# EAGLE design v0.4.0 (EAGLE 9.2.0)

## Sheet 1 of 2: Interface
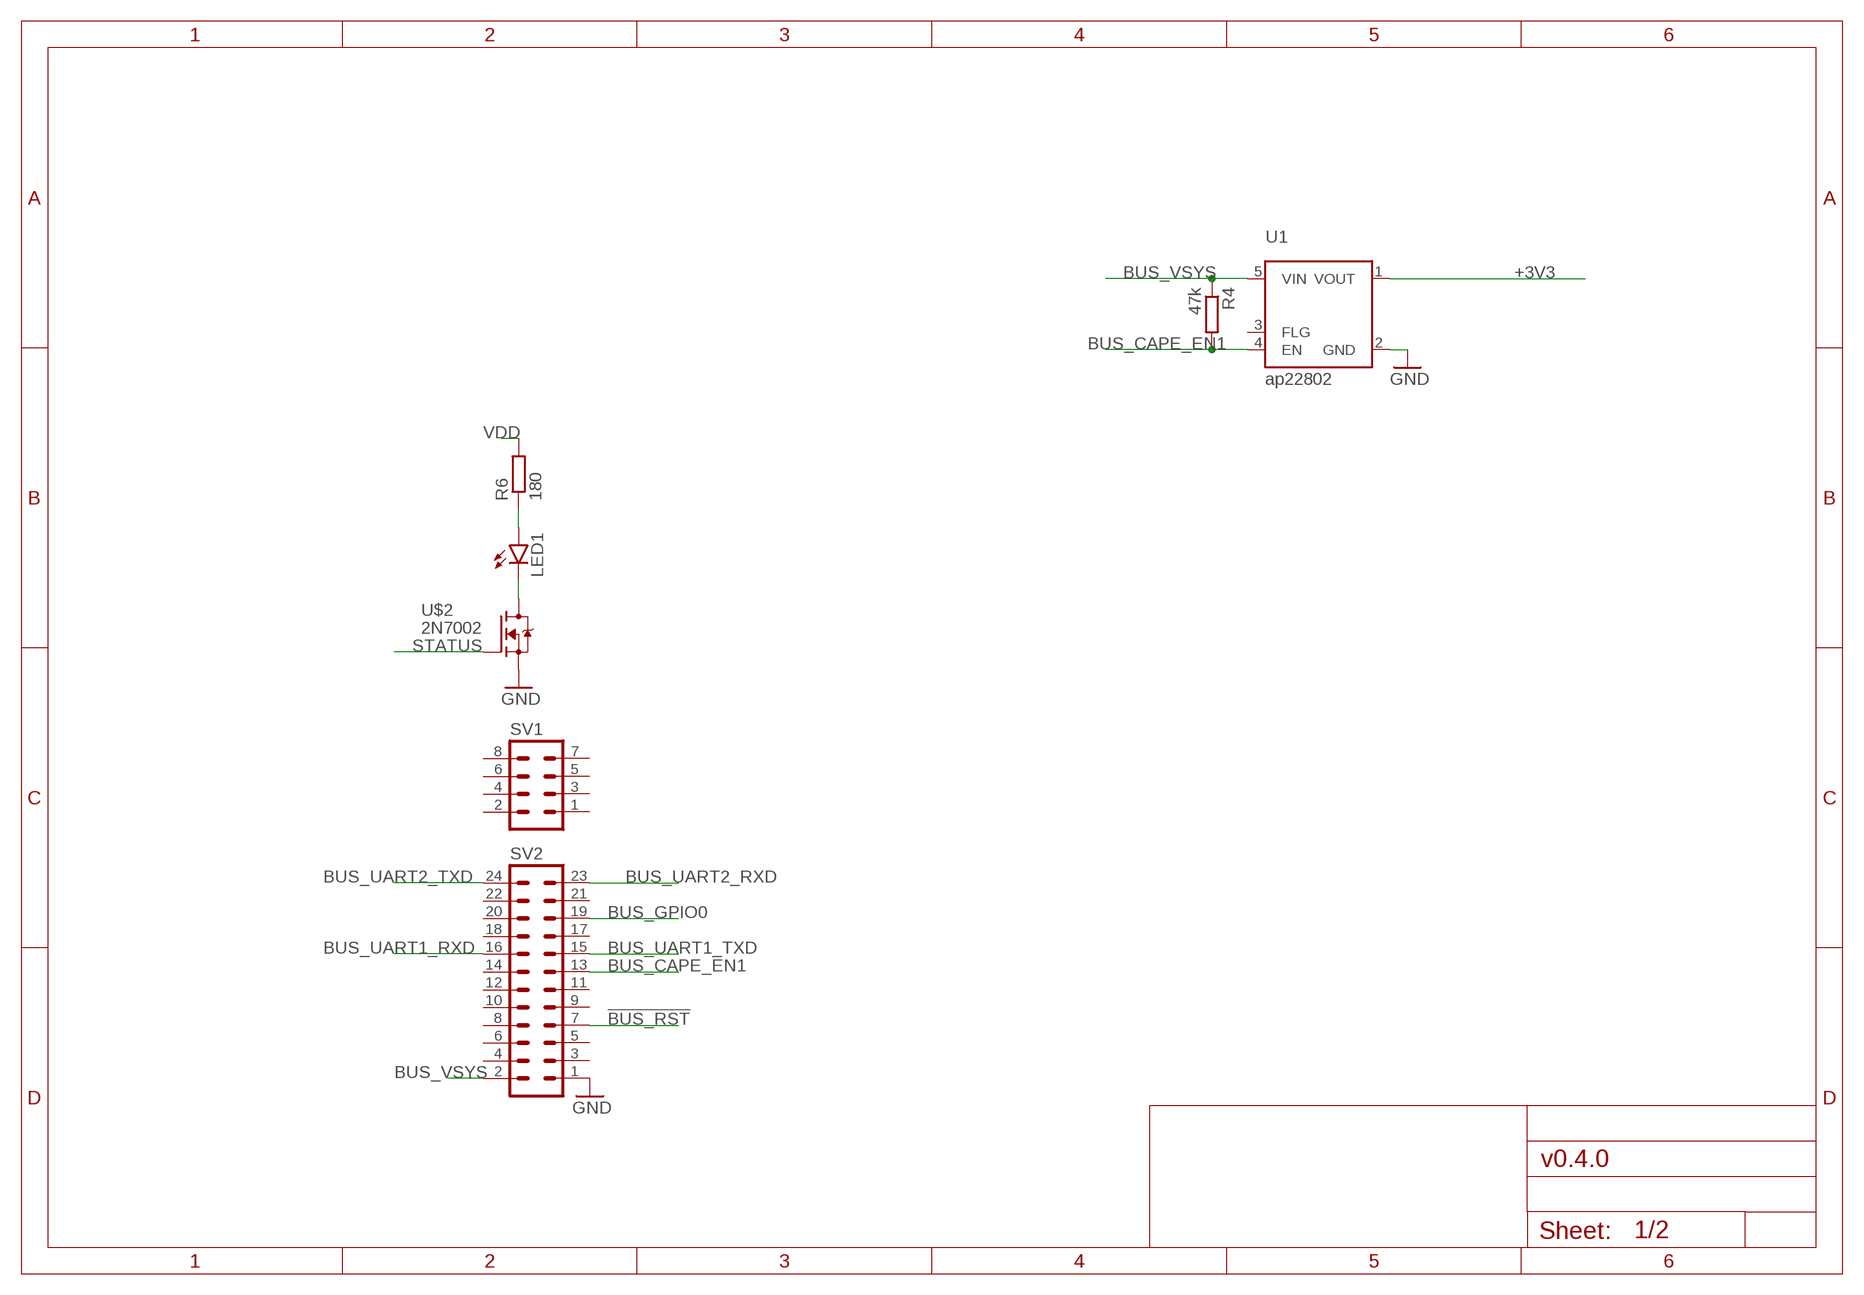
[diagram p0: schematic, sheet 1]

### Parts
LED1  LEDCHIP-LED0603  [CHIP-LED0603]
R4  47k  R-EU_R0402  [R0402]
R6  180  R-EU_R0402  [R0402]
SV1  MA04-2  [MA04-2]
SV2  MA12-2  [MA12-2]
U1  ap22802  AP22802  [SOT25]
U$2  2N7002  [SOT95P240X110-3]

### Nets
!BUS_RST: SV2.7 ; also sheet 2
+3V3: U1.1(VOUT) ; also sheet 2
BUS_CAPE_EN1: R4.2 SV2.13 U1.4(EN) ; also sheet 2
BUS_GPIO0: SV2.19 ; also sheet 2
BUS_UART1_RXD: SV2.16 ; also sheet 2
BUS_UART1_TXD: SV2.15 ; also sheet 2
BUS_UART2_RXD: SV2.23 ; also sheet 2
BUS_UART2_TXD: SV2.24 ; also sheet 2
BUS_VSYS: R4.1 SV2.2 U1.5(VIN)
GND: SV2.1 U1.2(GND) U$2.2(S) ; also sheet 2
N$6: LED1.C U$2.3(D)
N$12: LED1.A R6.1
STATUS: U$2.1(G) ; also sheet 2
VDD: R6.2 ; also sheet 2
Unconnected: SV1.1 SV1.2 SV1.3 SV1.4 SV1.5 SV1.6 SV1.7 SV1.8 SV2.3 SV2.4 SV2.5 SV2.6 SV2.8 SV2.9 SV2.10 SV2.11 SV2.12 SV2.14 SV2.17 SV2.18 SV2.20 SV2.21 SV2.22 U1.3(FLG)

## Sheet 2 of 2: GSM modem
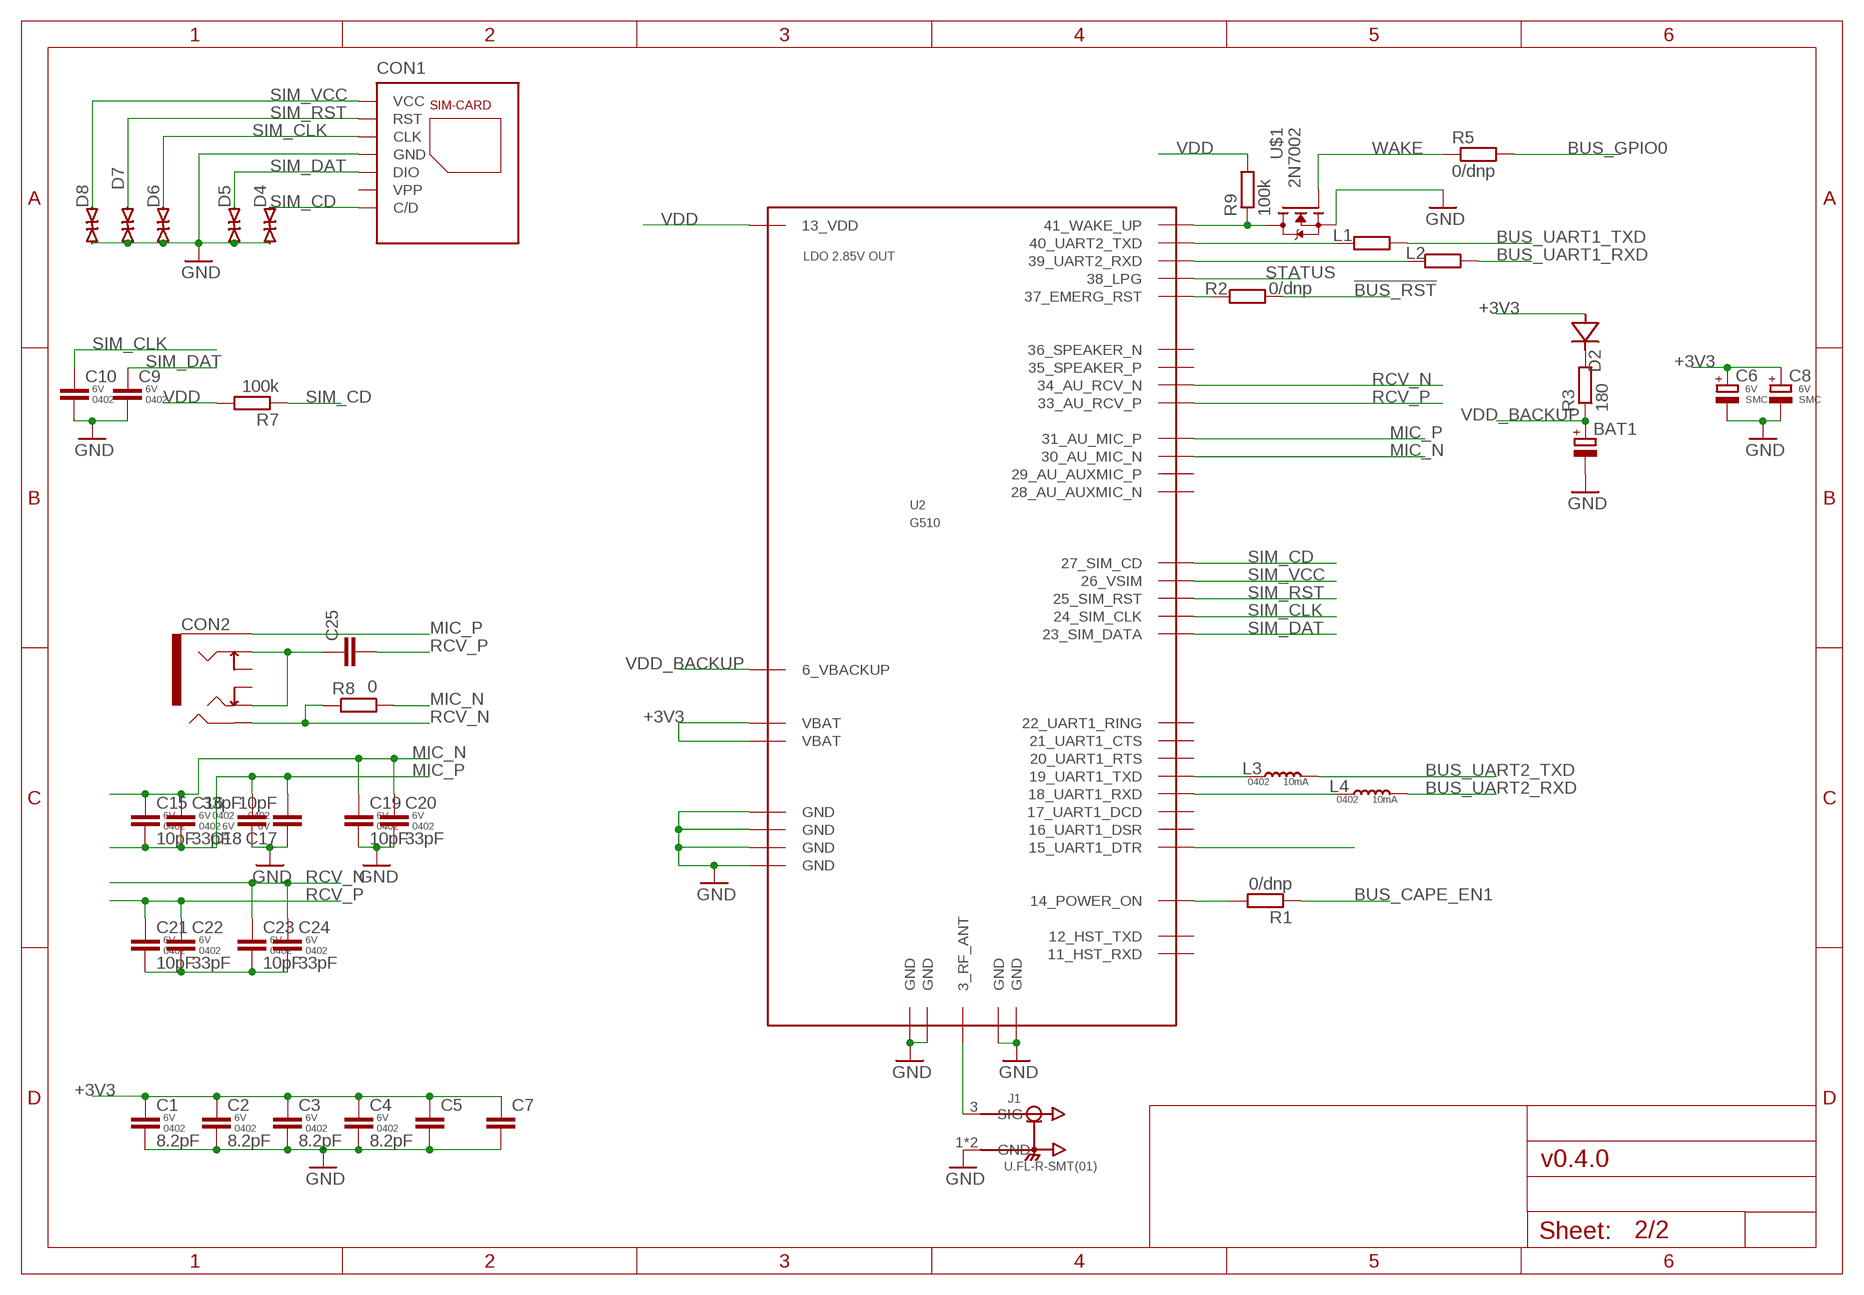
[diagram p1: schematic, sheet 2]

### Parts
BAT1  DCK-3R3E224U-E  [621]
C1  8.2pF  CAP-0402  [C0402K]
C2  8.2pF  CAP-0402  [C0402K]
C3  8.2pF  CAP-0402  [C0402K]
C4  8.2pF  CAP-0402  [C0402K]
C5  C-EUC0603  [C0603]
C6  CAP-POL-SMC  [SMC_C]
C7  C-EUC0603  [C0603]
C8  CAP-POL-SMC  [SMC_C]
C9  CAP-0402  [C0402K]
C10  CAP-0402  [C0402K]
C15  10pF  CAP-0402  [C0402K]
C16  33pF  CAP-0402  [C0402K]
C17  10pF  CAP-0402  [C0402K]
C18  33pF  CAP-0402  [C0402K]
C19  10pF  CAP-0402  [C0402K]
C20  33pF  CAP-0402  [C0402K]
C21  10pF  CAP-0402  [C0402K]
C22  33pF  CAP-0402  [C0402K]
C23  10pF  CAP-0402  [C0402K]
C24  33pF  CAP-0402  [C0402K]
C25  C-EUC0603  [C0603]
CON1  115Q-BCA0  [115Q]
CON2  1503-21  [150321]
D2  1N4148WS  [SOD323]
D4  ESD9B5.0ST5G  [SOD1006X40]
D5  ESD9B5.0ST5G  [SOD1006X40]
D6  ESD9B5.0ST5G  [SOD1006X40]
D7  ESD9B5.0ST5G  [SOD1006X40]
D8  ESD9B5.0ST5G  [SOD1006X40]
J1  U.FL-R-SMT(01)  [HRS_U.FL-R-SMT(01)]
L1  R-EU_R0402  [R0402]
L2  R-EU_R0402  [R0402]
L3  IND-0402  [L0402]
L4  IND-0402  [L0402]
R1  0/dnp  R-EU_R0402  [R0402]
R2  0/dnp  R-EU_R0402  [R0402]
R3  180  R-EU_R0402  [R0402]
R5  0/dnp  R-EU_R0402  [R0402]
R7  100k  R-EU_R0402  [R0402]
R8  0  R-EU_R0402  [R0402]
R9  100k  R-EU_R0402  [R0402]
U2  G510  [G510]
U$1  2N7002  [SOT95P240X110-3]

### Nets
!BUS_RST: R2.2 ; also sheet 1
+3V3: C1.1 C2.1 C3.1 C4.1 C5.1 C6.+ C7.1 C8.+ D2.A U2.9_VBAT(VBAT) U2.10_VBAT(VBAT) ; also sheet 1
BUS_CAPE_EN1: R1.1 ; also sheet 1
BUS_GPIO0: R5.2 ; also sheet 1
BUS_UART1_RXD: L2.2 ; also sheet 1
BUS_UART1_TXD: L1.2 ; also sheet 1
BUS_UART2_RXD: L4.2 ; also sheet 1
BUS_UART2_TXD: L3.2 ; also sheet 1
GND: BAT1.- C1.2 C2.2 C3.2 C4.2 C5.2 C6.- C7.2 C8.- C9.2 C10.2 C17.1 C18.1 C19.2 C20.2 CON1.GND1(GND) CON1.GND2(GND) CON1.GND3(GND) CON1.GND4(GND) CON1.P5(GND) D4.1(A) D5.1(A) D6.1(A) D7.1(A) D8.1(A) J1.1(GND) J1.2(GND) U2.1_GND(GND) U2.2_GND(GND) U2.4_GND(GND) U2.5_GND(GND) U2.7_GND(GND) U2.8_GND(GND) U2.32_GND(GND) U2.42_GND(GND) U$1.2(S) ; also sheet 1
MIC_N: C15.1 C16.1 C19.1 C20.1 R8.2 U2.30_AU_MIC_N
MIC_P: C15.2 C16.2 C17.2 C18.2 CON2.1 U2.31_AU_MIC_P
N$1: C21.2 C22.2 C23.2 C24.2
N$2: L3.1 U2.19_UART1_TXD
N$4: J1.3(SIG) U2.3_RF_ANT
N$5: U2.15_UART1_DTR
N$7: R9.1 U2.41_WAKE_UP U$1.3(D)
N$8: L4.1 U2.18_UART1_RXD
N$9: R2.1 U2.37_EMERG_RST
N$10: L1.1 U2.40_UART2_TXD
N$11: L2.1 U2.39_UART2_RXD
N$16: R1.2 U2.14_POWER_ON
N$20: D2.K(C) R3.2
N$21: C25.1 CON2.3 CON2.5
RCV_N: C23.1 C24.1 CON2.2 R8.1 U2.34_AU_RCV_N
RCV_P: C21.1 C22.1 C25.2 U2.33_AU_RCV_P
SIM_CD: CON1.CD(C/D) D4.2(C) R7.1 U2.27_SIM_CD
SIM_CLK: C10.1 CON1.P3(CLK) D6.2(C) U2.24_SIM_CLK
SIM_DAT: C9.1 CON1.P7(DIO) D5.2(C) U2.23_SIM_DATA
SIM_RST: CON1.P2(RST) D7.2(C) U2.25_SIM_RST
SIM_VCC: CON1.P1(VCC) D8.2(C) U2.26_VSIM
STATUS: U2.38_LPG ; also sheet 1
VDD: R7.2 R9.2 U2.13_VDD ; also sheet 1
VDD_BACKUP: BAT1.+ R3.1 U2.6_VBACKUP
WAKE: R5.1 U$1.1(G)
Unconnected: CON1.P6(VPP) CON2.4 CON2.6 U2.11_HSTRXD(11_HST_RXD) U2.12_HST_TXD U2.16_UART1_DSR U2.17_UART1_DCD U2.20_UART1_RTS U2.21_UART1_CTS U2.22_UART1_RING U2.28_AU_AUXMIC_N U2.29_AU_AUXMIC_P U2.35_SPEAKER_P U2.36_SPEAKER_N

## Library data of the parts
BAT1 = parts-elna:DCK-3R3E224U-E
C1-C4 C9 C10 C15-C24 = parts-passives:CAP-; PACKAGE: 0402; RATING: 6V
C5 C7 C25 = rcl:C-EU: CAPACITOR, European symbol; SPICEPREFIX: C
C6 C8 = parts-passives:CAP-POL-; PACKAGE: SMC; RATING: 6V
CON1 = parts-attend:115Q-BCA0
CON2 = parts-lumberg:1503-21
D2 = parts-diotec:1N4148WS
D4-D8 = parts-onsemi:ESD9B
J1 = parts-molex:U.FL-R-SMT(01): U.FL Series 6 Ghz 50 Ohm Ultra-small SMT Coaxial Cable Receptacle; AVAILABILITY: Unavailable; DESCRIPTION: U.FL Series 6 Ghz 50 Ohm Ultra-small SMT Coaxial Cable Receptacle; MF: Hirose; MP: U.FL-R-SMT_01_; PACKAGE: None; PRICE: None
L1 L2 R1-R9 = rcl:R-EU_: RESISTOR, European symbol; SPICEPREFIX: R
L3 L4 = parts-passives:IND-; CURRENT: 10mA; PACKAGE: 0402
LED1 = led:LED: LED OSRAM: - CHIPLED LG R971, LG N971, LY N971, LG Q971, LY Q971, LO R971, LY R971 LH N974, LH R974 LS Q976, LO Q976, LY Q976 LO Q996 - Hyper CHIPLED LW Q18S LB Q993, LB Q99A, LB R99A - SideLED LS A670, LO A670, LY A670, LG A670, LP A670 LB A673, LV A673, LT A673, LW A673 LH A674 LY A675 LS A676, LA A676, LO A676, LY A676, LW A676 LS A679, LY A679, LG A679 - Hyper Micro SIDELED® LS Y876, LA Y876, LO Y876, LY Y876 LT Y87S - SmartLED LW L88C, LW L88S LB L89C, LB L89S, LG L890 LS L89K, LO L89K, LY L89K LS L896, LA L896, LO L896, LY L896 - TOPLED LS T670, LO T670, LY T670, LG T670, LP T670 LSG T670, LSP T670, LSY T670, LOP T670, LYG T670 LG T671, LOG T671, LSG T671 LB T673, LV T673, LT T673, LW T673 LH T674 LS T676, LA T676, LO T676, LY T676, LB T676, LH T676, LSB T676, LW T676 LB T67C, LV T67C, LT T67C, LS T67K, LO T67K, LY T67K, LW E67C LS E67B, LA E67B, LO E67B, LY E67B, LB E67C, LV E67C, LT E67C LW T67C LS T679, LY T679, LG T679 LS T770, LO T770, LY T770, LG T770, LP T770 LB T773, LV T773, LT T773, LW T773 LH T774 LS E675, LA E675, LY E675, LS T675 LS T776, LA T776, LO T776, LY T776, LB T776 LHGB T686 LT T68C, LB T68C - Hyper Mini TOPLED® LB M676 - Mini TOPLED Santana® LG M470 LS M47K, LO M47K, LY M47K Source: http://www.osram.convergy.de LUXEON: - LUMILED® LXK2-PW12-R00, LXK2-PW12-S00, LXK2-PW14-U00, LXK2-PW14-V00 LXK2-PM12-R00, LXK2-PM12-S00, LXK2-PM14-U00 LXK2-PE12-Q00, LXK2-PE12-R00, LXK2-PE12-S00, LXK2-PE14-T00, LXK2-PE14-U00 LXK2-PB12-K00, LXK2-PB12-L00, LXK2-PB12-M00, LXK2-PB14-N00, LXK2-PB14-P00, LXK2-PB14-Q00 LXK2-PR12-L00, LXK2-PR12-M00, LXK2-PR14-Q00, LXK2-PR14-R00 LXK2-PD12-Q00, LXK2-PD12-R00, LXK2-PD12-S00 LXK2-PH12-R00, LXK2-PH12-S00 LXK2-PL12-P00, LXK2-PL12-Q00, LXK2-PL12-R00 Source: www.luxeon.com KINGBRIGHT: KA-3528ASYC Source: www.kingbright.com
SV1 = con-lstb:MA04-2: PIN HEADER; OC_FARNELL: unknown; OC_NEWARK: unknown
SV2 = con-lstb:MA12-2: PIN HEADER; OC_FARNELL: unknown; OC_NEWARK: unknown
U1 = parts-diodes:AP22802
U2 = parts-fibocom:G510
U$1 U$2 = parts-onsemi:2N7002

## Net classes
1 50_feed: width 1 mm, clearance 0.4 mm
2 usb_dif: width 0.4 mm, clearance 0.8 mm

## Board
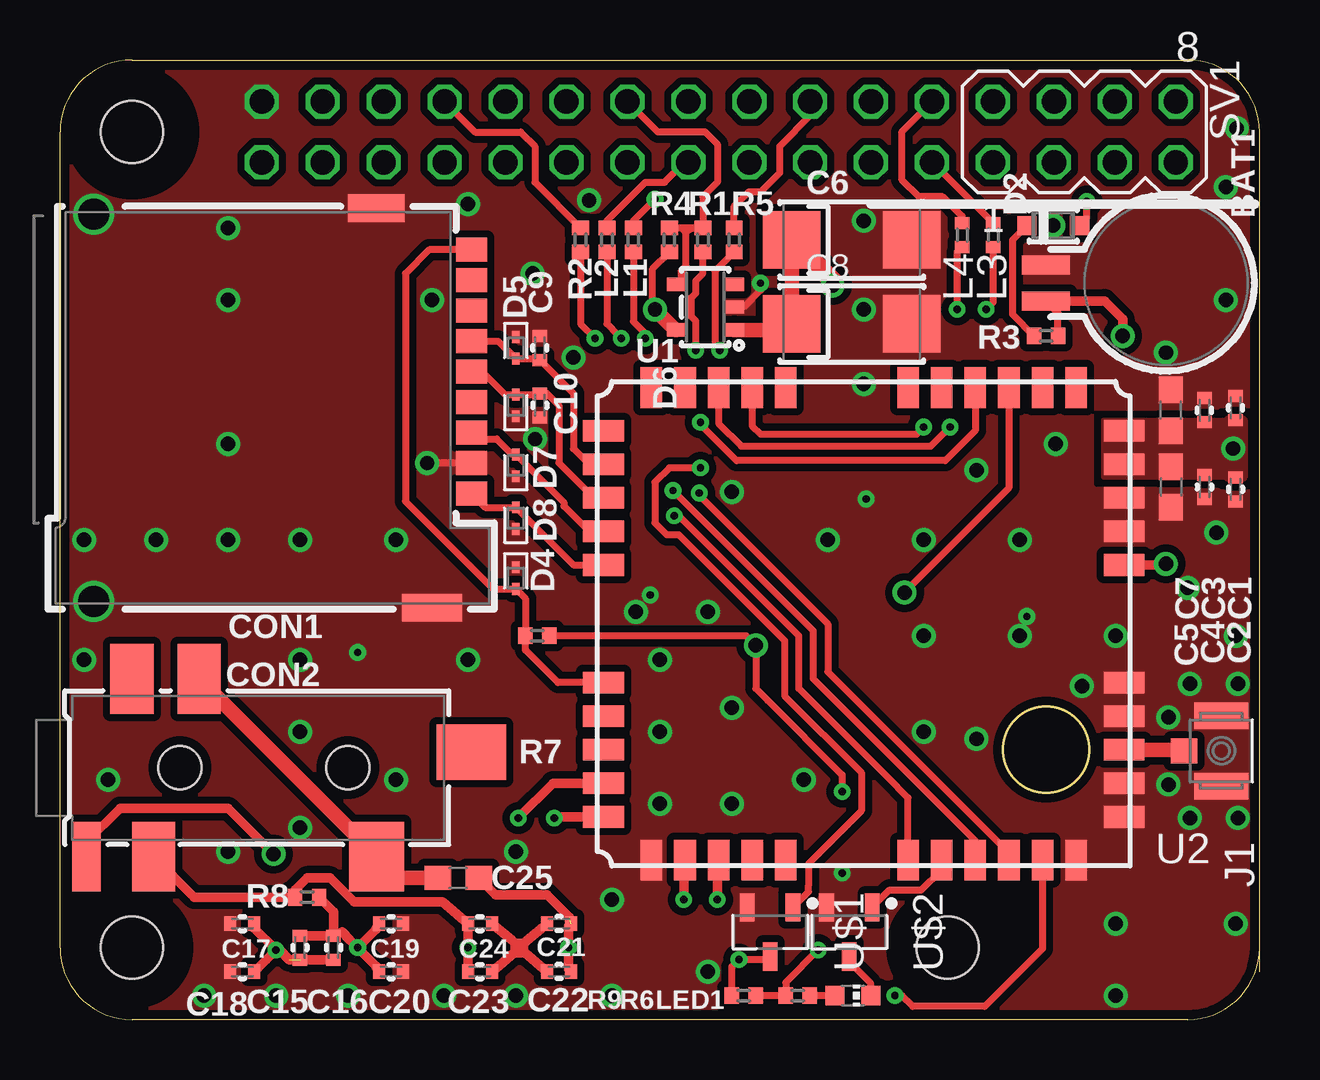
[diagram p2: board, top side]
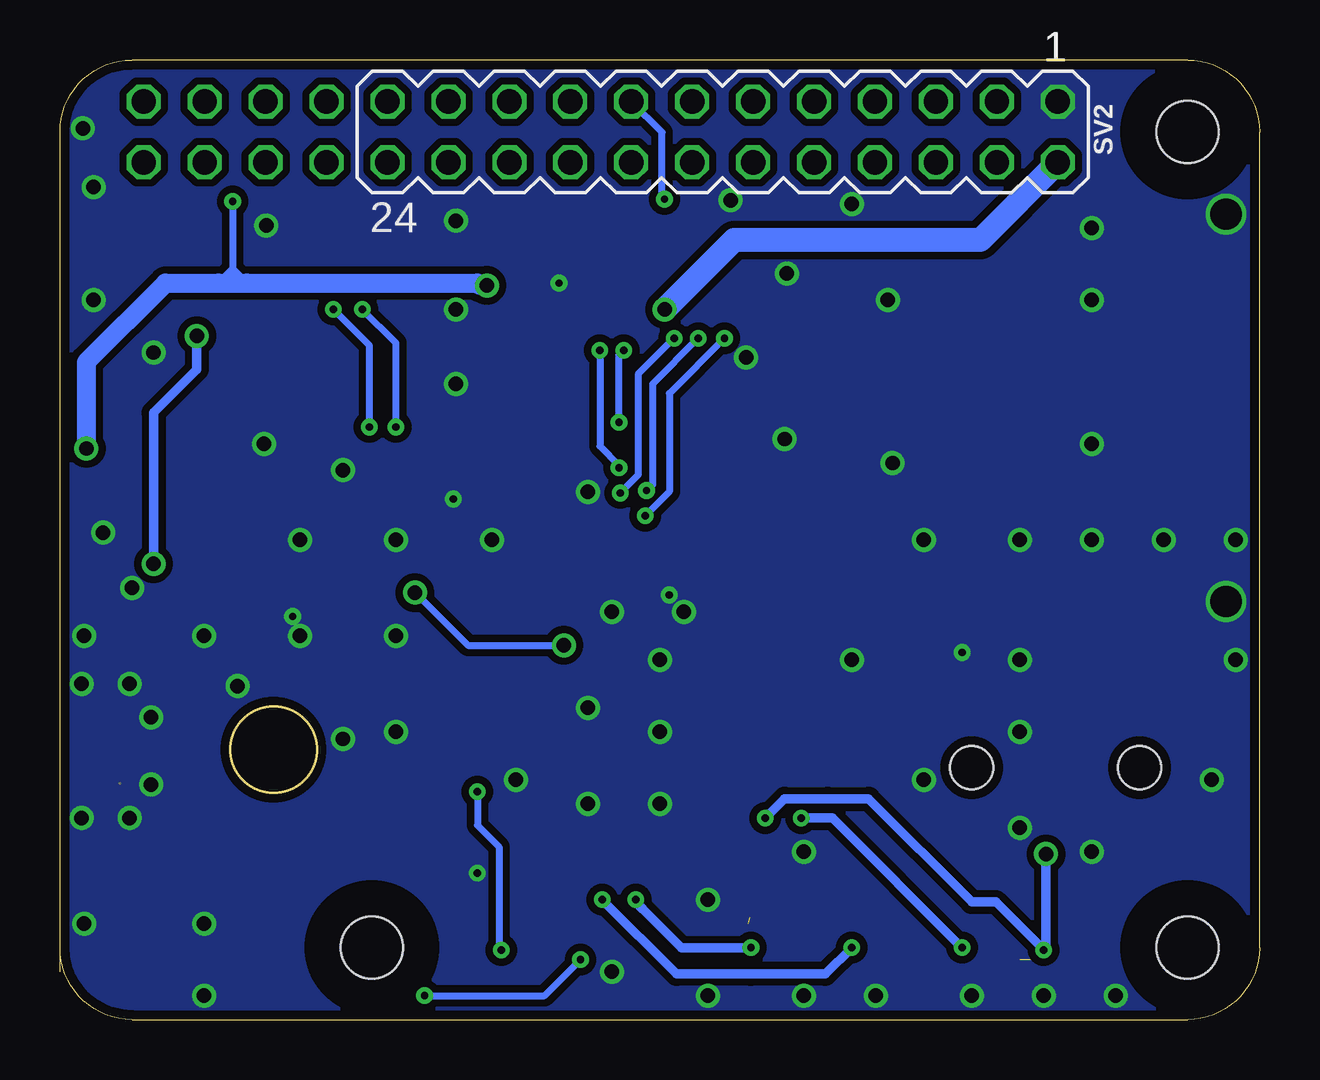
[diagram p3: board, bottom side, seen from below]

Size 50 x 40 mm. Coordinates in mm from the lower left corner, seen from the top.
Outline: 50,2 50,3
Outline: 50,3 arc-90 47,0 3,0 arc-90 0,3 0,37 arc-90 3,40 47,40 arc-90 50,37 50,3
Copper layers (1*16): Top 0.035mm / dielectric 0.53mm / Bottom 0.035mm
Design rules "default *": minimum track width 0.2mm, minimum drill 0.3mm, track to track 0.2mm, track to pad 0.2mm, pad to pad 0.2mm, via to via 0.2mm, smd to smd 6mil, copper to edge 0.4mm, drill to drill 0.2mm, minimum pad ring 0.2mm, minimum via ring 0.2mm, stop-mask expansion 0.1mm, vias tented up to drill 0.6mm, thermal gap 10mil
Holes 2.6 mm at 3,37 3,3 37,3
tRestrict: area 0.5,34.5 to 5.5,39.5; area 0.8,0.8 to 5.2,5.2; area 34.8,0.8 to 39.2,5.2
bRestrict: area 0.5,34.5 to 5.5,39.5; area 0.5,0.5 to 5.5,5.5; area 34.5,0.5 to 39.5,5.5

### Footprints (pad centres in the part's own frame; a part is rotated, then mirrored left to right if it is on the bottom)
621 = smd 0.8 x 2: + 0.75,-1.6; - -0.75,-1.6
C0402K = smd 0.5 x 0.6: 1 -0.5,0; 2 0.5,0
C0603 = smd 1.1 x 1: 1 -0.85,0; 2 0.85,0
SMC_C = smd 2.4 x 2.4: + -2.5,0; - 2.5,0
115Q = smd 1 x 1.3: CD -6.59,0.65; P1 3.57,0.65; P2 1.03,0.65; P3 -1.51,0.65; P4 -4.05,0.65; P5 2.3,0.65; P6 -0.24,0.65; P7 -2.78,0.65; P8 -5.32,0.65 | smd 1.15 x 2.35: GND1 -8.325,-3.32 | smd 1.15 x 2.5: GND2 8.325,-1 | drill 1.3: GND3 -8.07,-15.1; GND4 8.07,-15.1
150321 = smd 1.2 x 2.9: 1 3.9,3.7 | smd 1.8 x 2.9: 2 1.1,3.7; 5 -0.8,-3.7; 6 2,-3.7 | smd 2.3 x 2.9: 3 -8.2,3.7 | smd 2.9 x 2.3: 4 -12.15,-0.65 | hole 1.8: 0,0; -7,0
SOD323 = smd 0.8 x 0.8: A 1.1,0; K -1.1,0
SOD1006X40 = smd 0.495 x 0.32: 1 -0.453,0; 2 0.453,0
HRS_U.FL-R-SMT(01) = smd 1.1 x 2.25: 1 -1.475,0; 2 1.475,0 | smd 1.05 x 1.1: 3 0,-1.55
R0402 = smd 0.6 x 0.7: 1 -0.5,0; 2 0.5,0
L0402 = smd 0.5 x 0.6: 1 -0.5,0; 2 0.5,0
CHIP-LED0603 = smd 0.8 x 0.8: A 0,-0.75; C 0,0.75
MA04-2 = drill 1.016 octagon: 1 -3.81,-1.27; 2 -3.81,1.27; 3 -1.27,-1.27; 4 -1.27,1.27; 5 1.27,-1.27; 6 1.27,1.27; 7 3.81,-1.27; 8 3.81,1.27
MA12-2 = drill 1.016 octagon: 1 -13.97,-1.27; 2 -13.97,1.27; 3 -11.43,-1.27; 4 -11.43,1.27; 5 -8.89,-1.27; 6 -8.89,1.27; 7 -6.35,-1.27; 8 -6.35,1.27; 9 -3.81,-1.27; 10 -3.81,1.27; 11 -1.27,-1.27; 12 -1.27,1.27; 13 1.27,-1.27; 14 1.27,1.27; 15 3.81,-1.27; 16 3.81,1.27; 17 6.35,-1.27; 18 6.35,1.27; 19 8.89,-1.27; 20 8.89,1.27; 21 11.43,-1.27; 22 11.43,1.27; 23 13.97,-1.27; 24 13.97,1.27
SOT25 = smd 0.55 x 0.8: 1 -0.95,-1.2; 2 0,-1.2; 3 0.95,-1.2; 4 0.95,1.2; 5 -0.95,1.2
G510 = smd 0.9 x 1.7: 1_GND -8.05,-10.85; 2_GND -6.65,-10.85; 3_RF_ANT -5.25,-10.85; 4_GND -3.85,-10.85; 5_GND -2.45,-10.85; 6_VBACKUP 2.45,-10.85; 7_GND 3.85,-10.85; 8_GND 5.25,-10.85; 9_VBAT 6.65,-10.85; 10_VBAT 8.05,-10.85; 22_UART1_RING 8.05,10.85; 23_SIM_DATA 6.65,10.85; 24_SIM_CLK 5.25,10.85; 25_SIM_RST 3.85,10.85; 26_VSIM 2.45,10.85; 27_SIM_CD -2.45,10.85; 28_AU_AUXMIC_N -3.85,10.85; 29_AU_AUXMIC_P -5.25,10.85; 30_AU_MIC_N -6.65,10.85; 31_AU_MIC_P -8.05,10.85 | smd 1.7 x 0.9: 11_HSTRXD 9.85,-8.85; 12_HST_TXD 9.85,-7.45; 13_VDD 9.85,-6.05; 14_POWER_ON 9.85,-4.65; 15_UART1_DTR 9.85,-3.25; 16_UART1_DSR 9.85,-1.85; 17_UART1_DCD 9.85,3.25; 18_UART1_RXD 9.85,4.65; 19_UART1_TXD 9.85,6.05; 20_UART1_RTS 9.85,7.45; 21_UART1_CTS 9.85,8.85; 32_GND -9.85,8.85; 33_AU_RCV_P -9.85,7.45; 34_AU_RCV_N -9.85,6.05; 35_SPEAKER_P -9.85,4.65; 36_SPEAKER_N -9.85,3.25; 37_EMERG_RST -9.85,-1.85; 38_LPG -9.85,-3.25; 39_UART2_RXD -9.85,-4.65; 40_UART2_TXD -9.85,-6.05; 41_WAKE_UP -9.85,-7.45; 42_GND -9.85,-8.85
SOT95P240X110-3 = smd 1.18 x 0.609: 1 -1.024,0.95; 2 -1.024,-0.95; 3 1.024,0

### Placement (x,y rotation side)
BAT1  42.7,30.7 270 top
C1  49,25.5 90 top
C2  49,22.1 270 top
C3  47.7,25.4 90 top
C4  47.7,22.2 270 top
C5  46.3,22.2 270 top
C6  33,32.5 0 top
C7  46.3,25.4 90 top
C8  33,29 0 top
C9  20,28 90 top
C10  20,25.6 270 top
C15  10,3 270 top
C16  11.4,3 270 top
C17  7.6,4 0 top
C18  7.6,2 0 top
C19  13.8,4 0 top
C20  13.8,2 0 top
C21  20.8,2 180 top
C22  20.8,4 180 top
C23  17.5,2 0 top
C24  17.5,4 0 top
C25  16.6,5.9 0 top
CON1  16.5,25.5 270 top
CON2  5,10.5 180 top
D2  41.4,33.1 0 top
D4  19,18.4 270 top
D5  19,28 270 top
D6  19,25.6 90 top
D7  19,23.1 90 top
D8  19,20.9 90 top
J1  48.4,11.2 270 top
L1  23.9,32.5 90 top
L2  22.8,32.5 90 top
L3  38.9,32.7 90 top
L4  37.6,32.7 90 top
LED1  33.05,1 270 top
R1  26.8,32.5 270 top
R2  21.7,32.5 90 top
R3  41.1,28.5 180 top
R4  25.4,32.5 90 top
R5  28.1,32.5 90 top
R6  30.75,1 180 top
R7  19.9,16 0 top
R8  10.3,5.1 0 top
R9  28.5,1 0 top
SV1  42.7,37 0 top
SV2  22.38,37 180 bottom
U1  26.9,29.7 90 top
U2  33.5,16.5 90 top
U$1  29.6,3.65 270 top
U$2  32.9,3.65 270 top

### Tracks (layer width: path | path; a pad name or v marks a point on that pad's centre or on a via)
!BUS_RST
  Top 0.3: SV2.7 17.3,37 19.2,37 19.8,36.4 19.8,34.9 R2.2
+3V3  (via drill 0.3, 0.6)
  Top 0.3: D2.A 42.8,33.4 v42.8,34.1
  Top 0.6: U1.1 30.25,28.75 C8.+ C6.+
  Top 0.8: C6.+ 32.2,30.8 v32.2,30.6
  Bottom 0.3: v42.8,34.1 42.8,31.4 | 42.8,31.4 42.8,30.7 | 42.8,31.4 42.8,31.3 | 42.8,31.3 43.4,30.7 | 42.8,31.4 42.8,31.3 | 42.8,31.3 42.2,30.7
  Bottom 0.8: v48.9,23.8 48.9,27.4 45.6,30.7 43.4,30.7 42.8,30.7 42.2,30.7 32.6,30.7 32.5,30.6 v32.2,30.6
  pour Top (no thermals): 43.5,25 48.6,25 48.7,25.1 49.3,25.1 49.4,25 49.4,22.6 49.3,22.5 48.7,22.5 48.6,22.6 43.5,22.6
BUS_CAPE_EN1
  Top 0.3: SV2.13 24.92,37 26.9,37 27.4,36.5 27.4,34.9 26.8,34.3 R1.1 26.4,33 | 26.4,33 26.1,33 | 26.1,33 25.9,33 | 25.9,33 R4.2 | U1.4 25.9,30.85 25.9,31.2 26.1,31.4 26.1,32.8 | 26.1,32.8 26.1,33 | 26.1,32.8 25.9,33 | 26.1,32.8 26.3,33 26.4,33
BUS_GPIO0
  Top 0.3: SV2.19 31.27,37.67 30,36.4 30,35.3 29.2,34.5 28.7,34.5 28.1,33.9 R5.2
BUS_UART1_RXD
  Top 0.3: L2.2 22.8,33.3 24.4,34.9 25.2,34.9 26.03,35.73 SV2.16
BUS_UART1_TXD  (via drill 0.3)
  Top 0.3: L1.2 23.9,33.3 v24.8,34.2
  Bottom 0.3: v24.8,34.2 24.9,34.3 24.9,36.98 SV2.15
BUS_UART2_RXD
  Top 0.3: L4.2 37.6,33.5 36.8,34.3 35.8,34.3 35.1,35 35.1,37.02 SV2.23
BUS_UART2_TXD
  Top 0.3: L3.2 36.37,35.73 SV2.24
BUS_VSYS  (via drill 0.6)
  Top 0.3: v24.8,29.6 24.7,29.7 24.7,31.3 R4.1
  Top 0.6: U1.5 25.65,28.75 v24.8,29.6
  Bottom 1: SV2.2 11.64,32.5 21.9,32.5 v24.8,29.6
GND  (via drill 0.3, 0.6)
  Top 0.3: CON1.P5 v15.3,23.2 | U1.2 28.5,29.7 29.2,30.4 v29.2,30.7
  other vias: 21.4,27.6 19.7,31.1 33.5,26.5 33.5,29.6 33.5,33.3 48.6,34.7 46.1,27.8 48.6,30 48.2,20.3 49.1,14 47.1,14 46.2,12.6 42.6,13.9 38.2,11.7 46.2,9.8 49.1,8.4 47.1,8.4 24.6,17.7 40.3,16.8 33.6,21.7 12.4,15.3 32.6,6.1 41.4,33.1 41.5,24 38.2,22.9 4,20 6,1 9,1 12,1 16,1 19,1 23,1 44,1 44,4 49,4 44,16 49,16 40,16 36,16 36,12 40,20 47,18 36,20 32,20 28,22 27,17 24,17 25,12 25,9 28,9 31,10 28,13 25,15 27,2 23,5 19,7 14,10 10,12 10,8 7,7 2,10 1,15 1,20 7,20 14,20 10,20 17,15 10,15 7,24 7,30 7,33 15.5,30 17,34 22.05,34.15 49.05,37.15 19.8,24.2
  pour Top (isolate 0.3, rank 6, no thermals): -1,41 51,41 51,-1 -1,-1
  pour Bottom (isolate 0.3, rank 6, no thermals): -2,42 -2,-2 52,-2 52,42
MIC_N  (via drill 0.3)
  Top 0.4: C15.1 C16.1 | C20.1 13.15,2.25 v12.4,3 | v12.4,3 12.1,3.3 11.75,3.65 C16.1 | C19.1 13.15,3.75 v12.4,3 | C16.1 11.4,4.5 R8.2 | U2.30_AU_MIC_N 20.55,9.85 v19.1,8.4
  Bottom 0.4: v19.1,8.4 17.8,8.4 v12.4,3
MIC_P  (via drill 0.3, 0.6)  (1 unrouted)
  Top 0.4: v9,2.9 9.15,2.9 9.55,2.5 C16.2 | C18.2 8.25,2.15 8.6,2.5 | 8.6,2.5 v9,2.9 | CON2.1 1.1,7.4 2.5,8.8 7,8.8 v8.9,6.9 | v9,2.9 8.6,2.5 | U2.31_AU_MIC_P 20.65,8.45 v20.6,8.4 | C17.2 8.1,3.8 v9,2.9
  Bottom 0.4: v8.9,6.9 8.9,5.7 8.9,3.7 8.9,3 v9,2.9 11,4.9 12,4.9 16.3,9.2 18,9.2 19.8,9.2 v20.6,8.4
N$1
  Top 0.4: C21.2 19.38,2.77 | 19.38,2.77 19.02,3.12 | 19.02,3.12 18.82,3.33 | 18.82,3.33 C24.2 | C23.2 18.93,2.77 | 18.93,2.77 19.32,3.17 | 19.32,3.17 C22.2 | 19.02,3.12 19.27,3.12 19.32,3.17 | 19.32,3.17 19.32,2.83 19.38,2.77 | 19.38,2.77 18.98,2.77 | 18.98,2.77 18.93,2.77 | 18.98,3.17 18.98,2.77 | 18.82,3.33 18.98,3.17 | 18.98,3.17 19.32,3.17
N$2  (via drill 0.3)
  Top 0.3: U2.19_UART1_TXD 27.45,24.85 28.4,23.9 36.3,23.9 v37.1,24.7 | v38.6,29.6 38.9,29.9 L3.1
  Bottom 0.3: v37.1,24.7 37.1,28.1 v38.6,29.6
N$4
  Top 0.6: U2.3_RF_ANT 46.8,11.25 J1.3
N$6
  Top 0.3: LED1.C 33.8,1.51 32.9,2.41 U$2.3
N$7  (via drill 0.3)
  Top 0.3: U2.41_WAKE_UP 40.95,2.95 38.55,0.55 35.55,0.55 35.1,1 v34.8,1 | v28.3,2.5 28.32,2.48 | R9.1 28,2.2 v28.3,2.5 | U$1.3 29.47,2.5 v28.3,2.5
  Bottom 0.3: v34.8,1 29.8,1 v28.3,2.5
N$8  (via drill 0.3)
  Top 0.3: U2.18_UART1_RXD 28.85,24.75 29.2,24.4 35.7,24.4 v36,24.7 | v37.4,29.6 37.4,32 L4.1
  Bottom 0.3: v36,24.7 36,28.2 v37.4,29.6
N$9  (via drill 0.3)
  Top 0.3: R2.1 21.7,29 v22.3,28.4 | v25.6,21 25.8,21 30.8,16 30.8,13.8 34.5,10.1 35.35,9.25 U2.37_EMERG_RST
  Bottom 0.3: v22.3,28.4 24.6,26.1 24.6,22.01 v25.6,21.01 v25.6,21
N$10  (via drill 0.3)
  Top 0.3: U2.40_UART2_TXD 39.55,6.95 32,14.5 32,16.5 26.65,21.85 v26.65,21.95 | v24.4,28.4 24.4,28.6 23.9,29.1 L1.1
  Bottom 0.3: v26.65,21.95 25.9,22.7 25.9,26.9 v24.4,28.4
N$11  (via drill 0.3)
  Top 0.3: U2.39_UART2_RXD 38.15,7.45 31.4,14.2 31.4,16.2 v25.55,22.05 | v23.4,28.4 23.05,28.75 22.8,29 L2.1
  Bottom 0.3: v25.55,22.05 25.3,22.3 25.3,26.5 v23.4,28.4
N$12
  Top 0.3: LED1.A R6.1
N$16  (via drill 0.3)
  Top 0.3: U2.14_POWER_ON 38.15,24.55 36.9,23.3 28.2,23.3 26.7,24.8 v26.7,24.9 | R1.2 26.8,31.1 26.5,30.8 26.5,30.28 26.3,30.08 26.3,29.32 26.5,29.12 v26.5,27.9
  Bottom 0.3: v26.7,24.9 26.7,27.7 v26.5,27.9
N$20
  Top 0.3: D2.K 39.7,32.5 39.7,29.4 R3.2
N$21
  Top 0.6: CON2.5 CON2.3 14.1,5.9 C25.1
RCV_N  (via drill 0.3)
  Top 0.4: CON2.2 5.6,5.1 R8.1 9.8,5.4 10.3,5.9 11.25,5.9 12.25,4.9 15.95,4.9 C24.1 v17,3 C23.1 | v27.4,5 27.4,6.6 U2.34_AU_RCV_N
  Bottom 0.4: v17,3 18.1,1.9 21.2,1.9 24.3,1.9 v27.4,5
RCV_P  (via drill 0.3)  (1 unrouted)
  Top 0.4: C25.2 18.15,5.2 19.7,5.2 20.3,5.2 21.23,4.27 | v26,5 26,6.6 U2.33_AU_RCV_P | C22.1 21.2,3.9 v21.2,3 21.2,2.1 C21.1
  Bottom 0.4: v21.2,3 24.1,3 25.7,4.6 26,4.9 v26,5
SIM_CD
  Top 0.3: CON1.CD 15.39,32.09 14.4,31.1 14.4,21.6 18.05,17.95 D4.2 19.4,17.55 R7.1 19.4,15.4 20.75,14.05 U2.27_SIM_CD
SIM_CLK
  Top 0.3: 22.15,21.75 U2.24_SIM_CLK 22.25,21.75 20.8,23.2 20.8,25.6 20.3,26.1 C10.1 19.95,26.05 D6.2 18.55,26.05 17.59,27.01 CON1.P3 17.52,27.01
SIM_DAT
  Top 0.3: 22.15,23.15 U2.23_SIM_DATA 22.05,23.15 21.4,23.8 21.4,26.1 C9.1 19.95,27.55 D5.2 18.27,28.28 CON1.P7
SIM_RST
  Top 0.3: U2.25_SIM_RST 22,20.35 22,20.4 21,21.4 21,21.55 D7.2 18.85,23.55 18.2,24.2 17.42,24.2 CON1.P2
SIM_VCC
  Top 0.3: CON1.P1 17.73,21.35 D8.2 21.4,18.95 U2.26_VSIM
STATUS
  Top 0.3: U2.38_LPG 36.75,6.25 35.9,5.4 34.58,5.4 U$2.1
VDD  (via drill 0.3, 0.6)
  Top 0.3: U2.13_VDD 39.55,22.15 v35.2,17.8 | R7.2 21,16 28.6,16 v29,15.6 29,13.8 29.5,13.3 32.6,10.2 v32.6,9.5 | R9.2 R6.2 30.25,1.55 v31.6,2.9
  Bottom 0.3: v35.2,17.8 33,15.6 v29,15.6 | v32.6,9.5 32.6,8.1 31.7,7.2 31.7,3 v31.6,2.9
VDD_BACKUP  (via drill 0.6)
  Top 0.3: R3.1 41.6,29.45 BAT1.+
  Top 0.4: U2.6_VBACKUP 46.05,18.95 v46.1,19 | BAT1.+ 43.55,29.95 44.3,29.2 v44.3,28.5
  Bottom 0.4: v46.1,19 46.1,25.3 44.3,27.1 v44.3,28.5
WAKE  (via drill 0.3)
  Top 0.3: 28.12,32 R5.1 27.3,31.2 27.3,28.1 v27.5,27.9 | v26.7,23 25.4,23 24.8,22.4 24.8,20.7 25.3,20.2 25.8,20.2 30.2,15.8 30.2,13.5 33.4,10.3 33.4,8.7 31.2,6.5 31.2,5.6 31.2,5.32 U$1.1
  Bottom 0.3: v26.7,23 26.7,23.1 27.5,23.9 v27.5,27.9